# Altium schematic sheet 03_AIR724.SchDoc
size A4
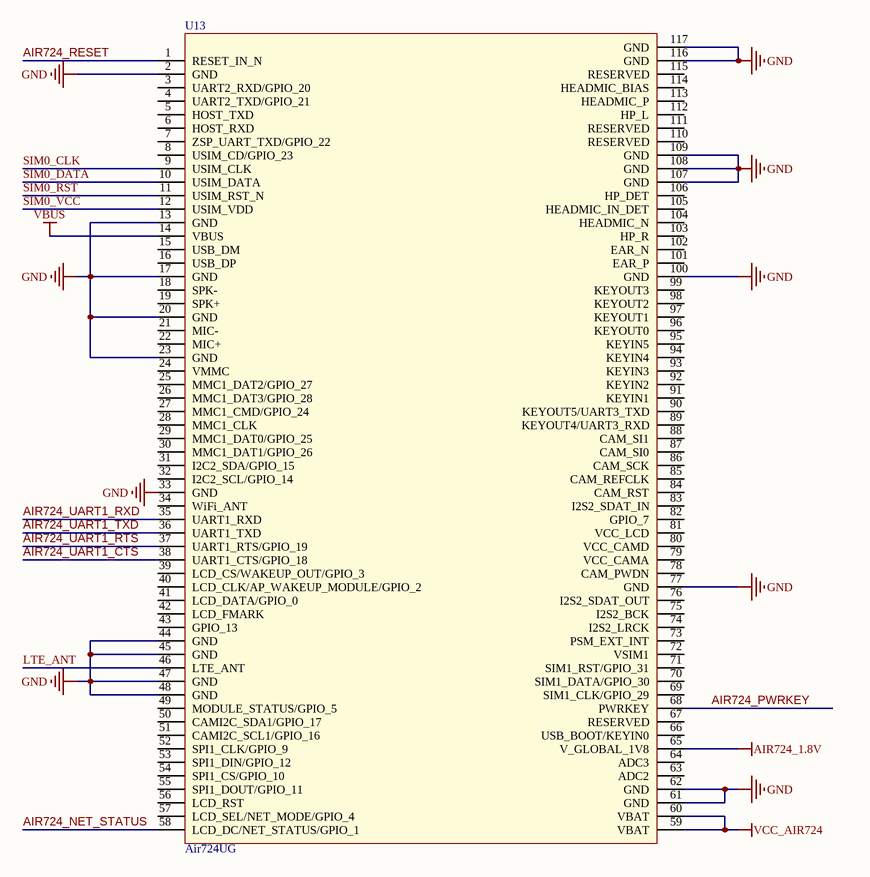
[diagram p0: 03_AIR724.SchDoc]

## Parts
U13  Air724UG  [AIR724UG]

## Nets
AIR724_1.8V: U13.65(V_GLOBAL_1V8)
GND: U13.2(GND) U13.13(GND) U13.17(GND) U13.20(GND) U13.23(GND) U13.33(GND) U13.44(GND) U13.45(GND) U13.47(GND) U13.48(GND) U13.61(GND) U13.62(GND) U13.77(GND) U13.100(GND) U13.107(GND) U13.108(GND) U13.109(GND) U13.116(GND) U13.117(GND)
VBUS: U13.14(VBUS)
VCC_AIR724: U13.59(VBAT) U13.60(VBAT)
AIR724_NET_STATUS: U13.58(LCD_DC/NET_STATUS/GPIO_1)
AIR724_PWRKEY: U13.68(PWRKEY)
AIR724_RESET: U13.1(RESET_IN_N)
AIR724_UART1_CTS: U13.38(UART1_CTS/GPIO_18)
AIR724_UART1_RTS: U13.37(UART1_RTS/GPIO_19)
AIR724_UART1_RXD: U13.35(UART1_RXD)
AIR724_UART1_TXD: U13.36(UART1_TXD)
LTE_ANT: U13.46(LTE_ANT)
SIM0_CLK: U13.9(USIM_CLK)
SIM0_DATA: U13.10(USIM_DATA)
SIM0_RST: U13.11(USIM_RST_N)
SIM0_VCC: U13.12(USIM_VDD)

Not connected (* = marked no-connect by the designer): U13 3(UART2_RXD/GPIO_20) 4(UART2_TXD/GPIO_21) 5(HOST_TXD) 6(HOST_RXD) 7(ZSP_UART_TXD/GPIO_22) 8(USIM_CD/GPIO_23) 15(USB_DM) 16(USB_DP) 18(SPK-) 19(SPK+) 21(MIC-) 22(MIC+) 24(VMMC) 25(MMC1_DAT2/GPIO_27) 26(MMC1_DAT3/GPIO_28) 27(MMC1_CMD/GPIO_24) 28(MMC1_CLK) 29(MMC1_DAT0/GPIO_25) 30(MMC1_DAT1/GPIO_26) 31(I2C2_SDA/GPIO_15) 32(I2C2_SCL/GPIO_14) 34(WiFi_ANT) 39(LCD_CS/WAKEUP_OUT/GPIO_3) 40(LCD_CLK/AP_WAKEUP_MODULE/GPIO_2) 41(LCD_DATA/GPIO_0) 42(LCD_FMARK) 43(GPIO_13) 49(MODULE_STATUS/GPIO_5) 50(CAMI2C_SDA1/GPIO_17) 51(CAMI2C_SCL1/GPIO_16) 52(SPI1_CLK/GPIO_9) 53(SPI1_DIN/GPIO_12) 54(SPI1_CS/GPIO_10) 55(SPI1_DOUT/GPIO_11) 56(LCD_RST) 57(LCD_SEL/NET_MODE/GPIO_4) 63(ADC2) 64(ADC3) 66(USB_BOOT/KEYIN0) 67(RESERVED) 69(SIM1_CLK/GPIO_29) 70(SIM1_DATA/GPIO_30) 71(SIM1_RST/GPIO_31) 72(VSIM1) 73(PSM_EXT_INT) 74(I2S2_LRCK) 75(I2S2_BCK) 76(I2S2_SDAT_OUT) 78(CAM_PWDN) 79(VCC_CAMA) 80(VCC_CAMD) 81(VCC_LCD) 82(GPIO_7) 83(I2S2_SDAT_IN) 84(CAM_RST) 85(CAM_REFCLK) 86(CAM_SCK) 87(CAM_SI0) 88(CAM_SI1) 89(KEYOUT4/UART3_RXD) 90(KEYOUT5/UART3_TXD) 91(KEYIN1) 92(KEYIN2) 93(KEYIN3) 94(KEYIN4) 95(KEYIN5) 96(KEYOUT0) 97(KEYOUT1) 98(KEYOUT2) 99(KEYOUT3) 101(EAR_P) 102(EAR_N) 103(HP_R) 104(HEADMIC_N) 105(HEADMIC_IN_DET) 106(HP_DET) 110(RESERVED) 111(RESERVED) 112(HP_L) 113(HEADMIC_P) 114(HEADMIC_BIAS) 115(RESERVED)

## Library data of the parts
U13 = Air724UG: Manufacturer: Luat(合宙); Symbol: AIR724UG-NA; Add into BOM: yes; Device: Air724UG-NA; LCSC Part Name: 合宙Luat 4G Cat.1模组Air724UG; Supplier Part: C559028; Manufacturer Part: Air724UG-NA; Supplier Footprint: SMD; JLCPCB Part Class: 扩展库; Supplier: LCSC; Convert to PCB: yes